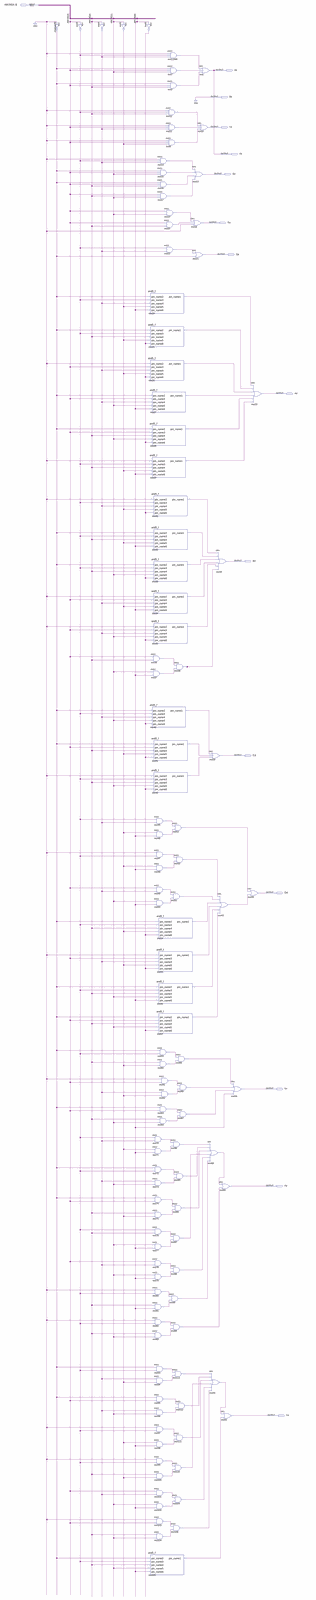
[diagram p0: schematic sheet, whole]
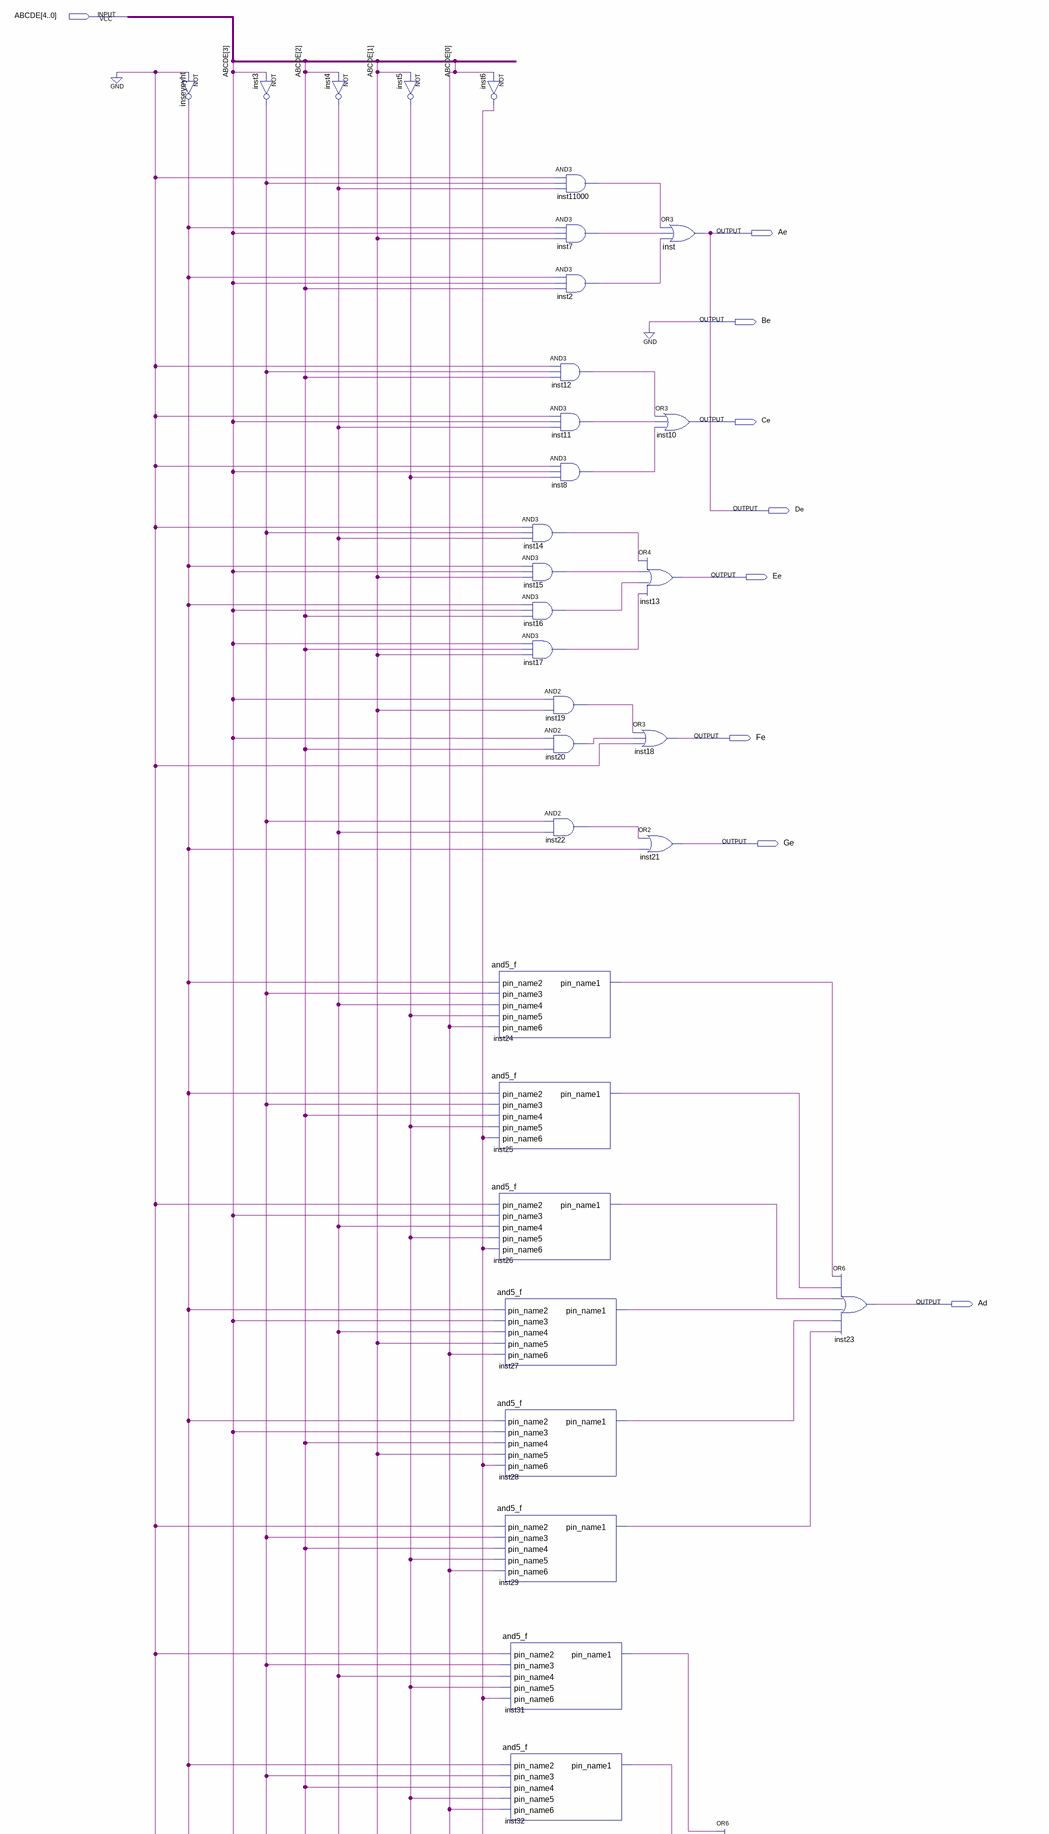
[diagram p1: schematic sheet, upper part]
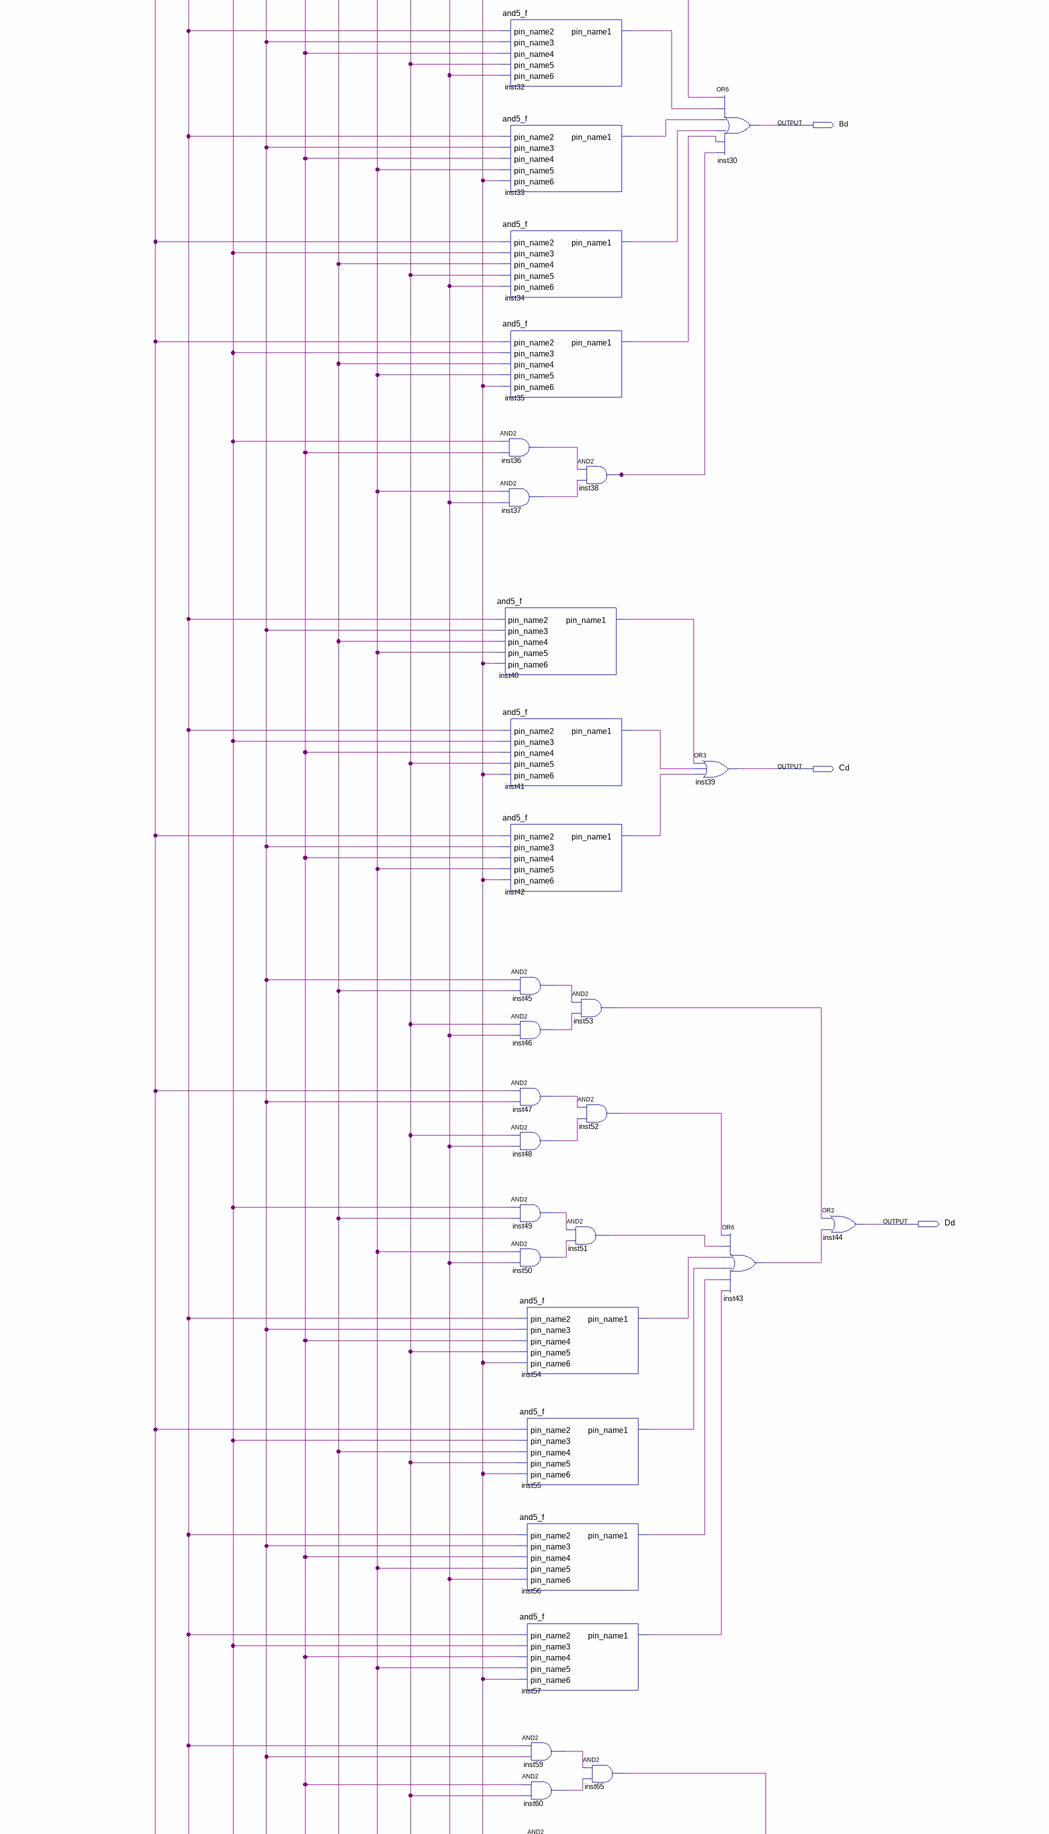
[diagram p2: schematic sheet, middle part]
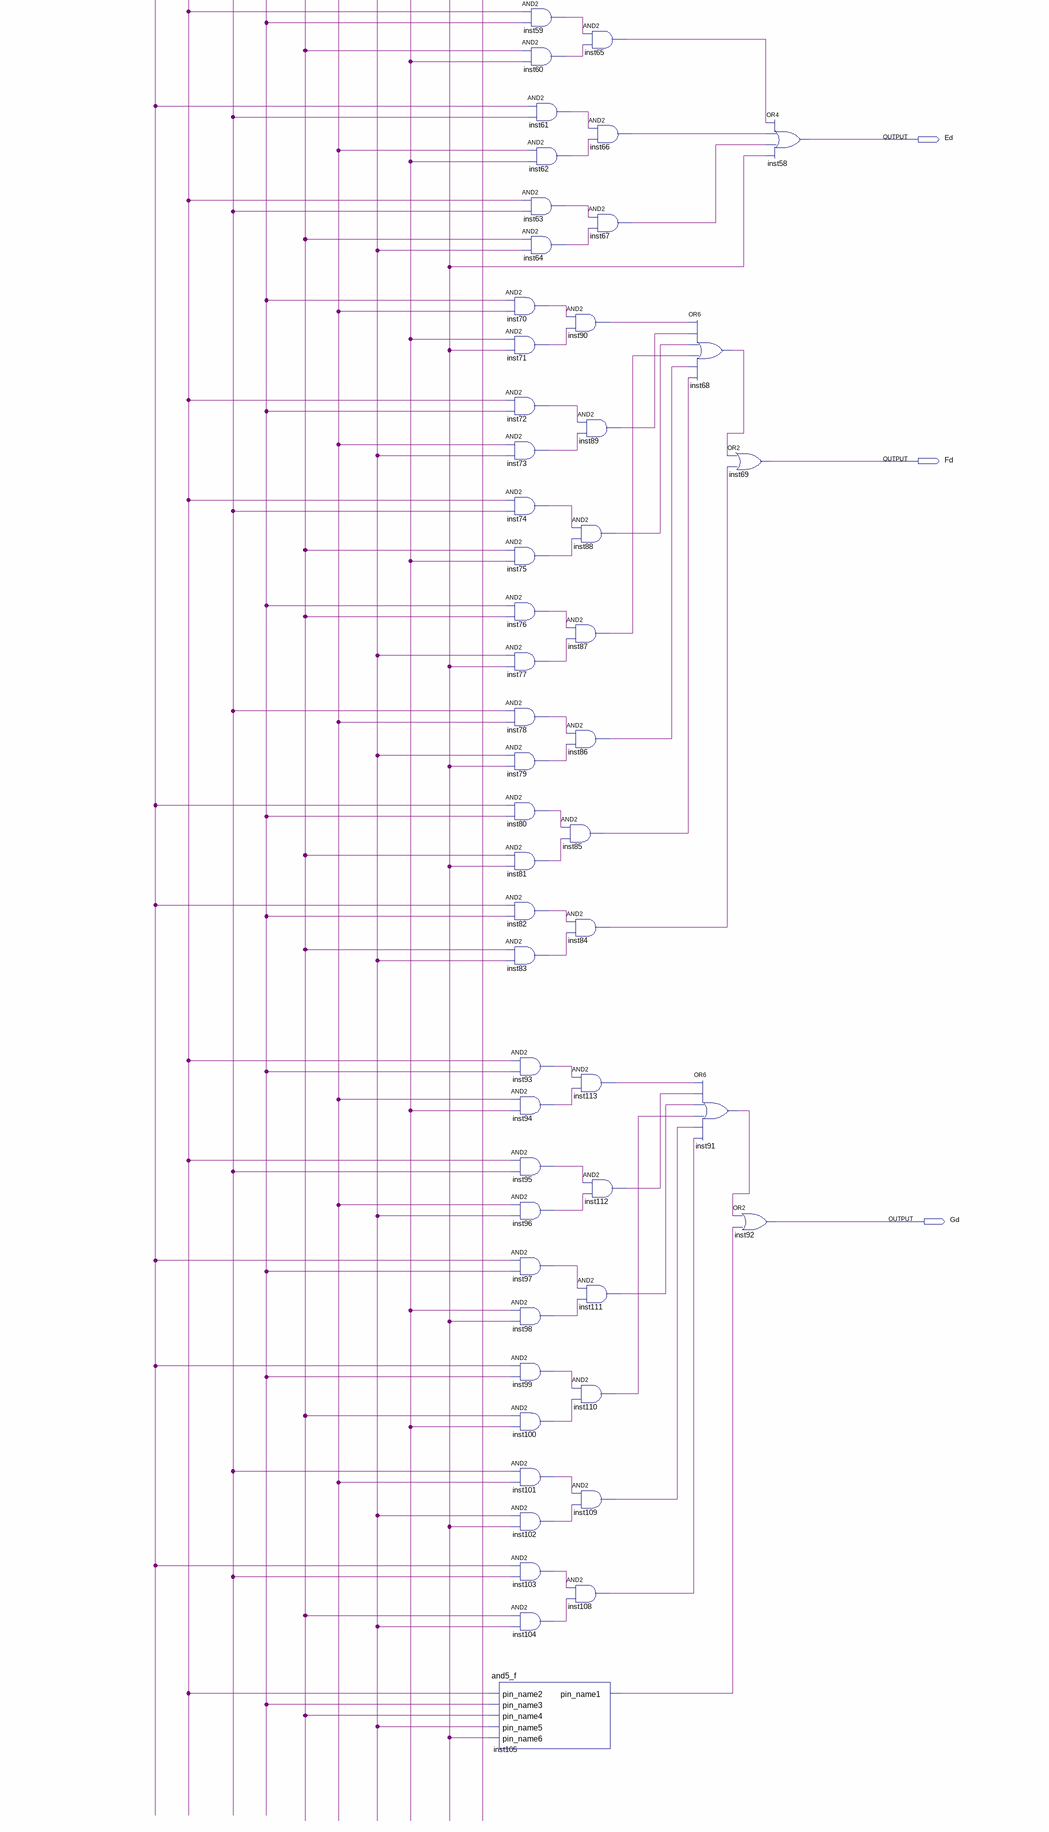
[diagram p3: schematic sheet, lower part]
// Quartus schematic DEC_4BITS.bdf as structural Verilog: 112 symbols, 15 pins
module DEC_4BITS (
  input  [4:0] ABCDE,
  output Ae,
  output Be,
  output Ce,
  output De,
  output Ee,
  output Fe,
  output Ge,
  output Ad,
  output Bd,
  output Cd,
  output Dd,
  output Ed,
  output Fd,
  output Gd
);

  wire inseyeyht_out, inst2_out, inst3_out, inst4_out, inst5_out, inst6_out, inst7_out, inst8_out,
       inst11_out, inst12_out, inst14_out, inst15_out, inst16_out, inst17_out, inst19_out, inst20_out,
       inst22_out, inst24_pin_name1, inst25_pin_name1, inst26_pin_name1, inst27_pin_name1, inst28_pin_name1,
       inst29_pin_name1, inst31_pin_name1, inst32_pin_name1, inst33_pin_name1, inst34_pin_name1,
       inst35_pin_name1, inst36_out, inst37_out, inst38_out, inst40_pin_name1, inst41_pin_name1,
       inst42_pin_name1, inst43_out, inst45_out, inst46_out, inst47_out, inst48_out, inst49_out, inst50_out,
       inst51_out, inst52_out, inst53_out, inst54_pin_name1, inst55_pin_name1, inst56_pin_name1,
       inst57_pin_name1, inst59_out, inst60_out, inst61_out, inst62_out, inst63_out, inst64_out, inst65_out,
       inst66_out, inst67_out, inst68_out, inst70_out, inst71_out, inst72_out, inst73_out, inst74_out,
       inst75_out, inst76_out, inst77_out, inst78_out, inst79_out, inst80_out, inst81_out, inst82_out,
       inst83_out, inst84_out, inst85_out, inst86_out, inst87_out, inst88_out, inst89_out, inst90_out,
       inst91_out, inst93_out, inst94_out, inst95_out, inst96_out, inst97_out, inst98_out, inst99_out,
       inst100_out, inst101_out, inst102_out, inst103_out, inst104_out, inst105_pin_name1, inst108_out,
       inst109_out, inst110_out, inst111_out, inst112_out, inst113_out, inst11000_out;

  not inseyeyht (inseyeyht_out, 1'b0);
  not inst3 (inst3_out, ABCDE[3]);
  not inst4 (inst4_out, ABCDE[2]);
  not inst5 (inst5_out, ABCDE[1]);
  not inst6 (inst6_out, ABCDE[0]);
  and5_f inst24 (
    .pin_name2(inseyeyht_out), .pin_name3(inst3_out), .pin_name4(inst4_out), .pin_name5(inst5_out),
    .pin_name6(ABCDE[0]), .pin_name1(inst24_pin_name1));
  and5_f inst25 (
    .pin_name2(inseyeyht_out), .pin_name3(inst3_out), .pin_name4(ABCDE[2]), .pin_name5(inst5_out),
    .pin_name6(inst6_out), .pin_name1(inst25_pin_name1));
  and5_f inst26 (
    .pin_name2(1'b0), .pin_name3(ABCDE[3]), .pin_name4(inst4_out), .pin_name5(inst5_out),
    .pin_name6(inst6_out), .pin_name1(inst26_pin_name1));
  and5_f inst27 (
    .pin_name2(inseyeyht_out), .pin_name3(ABCDE[3]), .pin_name4(inst4_out), .pin_name5(ABCDE[1]),
    .pin_name6(ABCDE[0]), .pin_name1(inst27_pin_name1));
  and5_f inst28 (
    .pin_name2(inseyeyht_out), .pin_name3(ABCDE[3]), .pin_name4(ABCDE[2]), .pin_name5(ABCDE[1]),
    .pin_name6(inst6_out), .pin_name1(inst28_pin_name1));
  and5_f inst29 (
    .pin_name2(1'b0), .pin_name3(inst3_out), .pin_name4(ABCDE[2]), .pin_name5(inst5_out),
    .pin_name6(ABCDE[0]), .pin_name1(inst29_pin_name1));
  and5_f inst31 (
    .pin_name2(1'b0), .pin_name3(inst3_out), .pin_name4(inst4_out), .pin_name5(inst5_out),
    .pin_name6(inst6_out), .pin_name1(inst31_pin_name1));
  and5_f inst32 (
    .pin_name2(inseyeyht_out), .pin_name3(inst3_out), .pin_name4(ABCDE[2]), .pin_name5(inst5_out),
    .pin_name6(ABCDE[0]), .pin_name1(inst32_pin_name1));
  and5_f inst33 (
    .pin_name2(inseyeyht_out), .pin_name3(inst3_out), .pin_name4(ABCDE[2]), .pin_name5(ABCDE[1]),
    .pin_name6(inst6_out), .pin_name1(inst33_pin_name1));
  and5_f inst34 (
    .pin_name2(1'b0), .pin_name3(ABCDE[3]), .pin_name4(inst4_out), .pin_name5(inst5_out),
    .pin_name6(ABCDE[0]), .pin_name1(inst34_pin_name1));
  and5_f inst35 (
    .pin_name2(1'b0), .pin_name3(ABCDE[3]), .pin_name4(inst4_out), .pin_name5(ABCDE[1]),
    .pin_name6(inst6_out), .pin_name1(inst35_pin_name1));
  and inst36 (inst36_out, ABCDE[3], ABCDE[2]);
  and inst37 (inst37_out, ABCDE[1], ABCDE[0]);
  and5_f inst40 (
    .pin_name2(inseyeyht_out), .pin_name3(inst3_out), .pin_name4(inst4_out), .pin_name5(ABCDE[1]),
    .pin_name6(inst6_out), .pin_name1(inst40_pin_name1));
  and5_f inst41 (
    .pin_name2(inseyeyht_out), .pin_name3(ABCDE[3]), .pin_name4(ABCDE[2]), .pin_name5(inst5_out),
    .pin_name6(inst6_out), .pin_name1(inst41_pin_name1));
  and5_f inst42 (
    .pin_name2(1'b0), .pin_name3(inst3_out), .pin_name4(ABCDE[2]), .pin_name5(ABCDE[1]),
    .pin_name6(inst6_out), .pin_name1(inst42_pin_name1));
  and inst45 (inst45_out, inst3_out, inst4_out);
  and inst46 (inst46_out, inst5_out, ABCDE[0]);
  and inst47 (inst47_out, 1'b0, inst3_out);
  and inst48 (inst48_out, inst5_out, ABCDE[0]);
  and inst49 (inst49_out, ABCDE[3], inst4_out);
  and inst50 (inst50_out, ABCDE[1], ABCDE[0]);
  and inst70 (inst70_out, inst3_out, inst4_out);
  and inst71 (inst71_out, inst5_out, ABCDE[0]);
  and inst72 (inst72_out, inseyeyht_out, inst3_out);
  and inst73 (inst73_out, inst4_out, ABCDE[1]);
  and inst74 (inst74_out, inseyeyht_out, ABCDE[3]);
  and inst75 (inst75_out, ABCDE[2], inst5_out);
  and inst76 (inst76_out, inst3_out, ABCDE[2]);
  and inst77 (inst77_out, ABCDE[1], ABCDE[0]);
  and inst78 (inst78_out, ABCDE[3], inst4_out);
  and inst79 (inst79_out, ABCDE[1], ABCDE[0]);
  and inst80 (inst80_out, 1'b0, inst3_out);
  and inst81 (inst81_out, ABCDE[2], ABCDE[0]);
  and inst82 (inst82_out, 1'b0, inst3_out);
  and inst83 (inst83_out, ABCDE[2], ABCDE[1]);
  and inst93 (inst93_out, inseyeyht_out, inst3_out);
  and inst94 (inst94_out, inst4_out, inst5_out);
  and inst95 (inst95_out, inseyeyht_out, ABCDE[3]);
  and inst96 (inst96_out, inst4_out, ABCDE[1]);
  and inst97 (inst97_out, 1'b0, inst3_out);
  and inst98 (inst98_out, inst5_out, ABCDE[0]);
  and inst99 (inst99_out, 1'b0, inst3_out);
  and inst100 (inst100_out, ABCDE[2], inst5_out);
  and inst101 (inst101_out, ABCDE[3], inst4_out);
  and inst102 (inst102_out, ABCDE[1], ABCDE[0]);
  and inst103 (inst103_out, 1'b0, ABCDE[3]);
  and inst104 (inst104_out, ABCDE[2], ABCDE[1]);
  and5_f inst105 (
    .pin_name2(inseyeyht_out), .pin_name3(inst3_out), .pin_name4(ABCDE[2]), .pin_name5(ABCDE[1]),
    .pin_name6(ABCDE[0]), .pin_name1(inst105_pin_name1));
  and inst11000 (inst11000_out, 1'b0, inst3_out, inst4_out);
  and inst7 (inst7_out, inseyeyht_out, ABCDE[3], ABCDE[1]);
  and inst2 (inst2_out, inseyeyht_out, ABCDE[3], ABCDE[2]);
  and inst12 (inst12_out, 1'b0, inst3_out, ABCDE[2]);
  and inst11 (inst11_out, 1'b0, ABCDE[3], inst4_out);
  and inst8 (inst8_out, 1'b0, ABCDE[3], inst5_out);
  and inst14 (inst14_out, 1'b0, inst3_out, inst4_out);
  and inst15 (inst15_out, inseyeyht_out, ABCDE[3], ABCDE[1]);
  and inst16 (inst16_out, inseyeyht_out, ABCDE[3], ABCDE[2]);
  and inst17 (inst17_out, ABCDE[3], ABCDE[2], ABCDE[1]);
  and inst19 (inst19_out, ABCDE[3], ABCDE[1]);
  and inst20 (inst20_out, ABCDE[3], ABCDE[2]);
  and inst22 (inst22_out, inst3_out, inst4_out);
  and5_f inst54 (
    .pin_name2(inseyeyht_out), .pin_name3(inst3_out), .pin_name4(ABCDE[2]), .pin_name5(inst5_out),
    .pin_name6(inst6_out), .pin_name1(inst54_pin_name1));
  and5_f inst55 (
    .pin_name2(1'b0), .pin_name3(ABCDE[3]), .pin_name4(inst4_out), .pin_name5(inst5_out),
    .pin_name6(inst6_out), .pin_name1(inst55_pin_name1));
  and5_f inst56 (
    .pin_name2(inseyeyht_out), .pin_name3(inst3_out), .pin_name4(ABCDE[2]), .pin_name5(ABCDE[1]),
    .pin_name6(ABCDE[0]), .pin_name1(inst56_pin_name1));
  and5_f inst57 (
    .pin_name2(inseyeyht_out), .pin_name3(ABCDE[3]), .pin_name4(ABCDE[2]), .pin_name5(ABCDE[1]),
    .pin_name6(inst6_out), .pin_name1(inst57_pin_name1));
  and inst59 (inst59_out, inseyeyht_out, inst3_out);
  and inst60 (inst60_out, ABCDE[2], inst5_out);
  and inst61 (inst61_out, 1'b0, ABCDE[3]);
  and inst62 (inst62_out, inst4_out, inst5_out);
  and inst63 (inst63_out, inseyeyht_out, ABCDE[3]);
  and inst64 (inst64_out, ABCDE[2], ABCDE[1]);
  and inst38 (inst38_out, inst36_out, inst37_out);
  and inst53 (inst53_out, inst45_out, inst46_out);
  and inst52 (inst52_out, inst47_out, inst48_out);
  and inst51 (inst51_out, inst49_out, inst50_out);
  and inst65 (inst65_out, inst59_out, inst60_out);
  and inst66 (inst66_out, inst61_out, inst62_out);
  and inst67 (inst67_out, inst63_out, inst64_out);
  and inst90 (inst90_out, inst70_out, inst71_out);
  and inst89 (inst89_out, inst72_out, inst73_out);
  and inst88 (inst88_out, inst74_out, inst75_out);
  and inst87 (inst87_out, inst76_out, inst77_out);
  and inst86 (inst86_out, inst78_out, inst79_out);
  and inst85 (inst85_out, inst80_out, inst81_out);
  and inst84 (inst84_out, inst82_out, inst83_out);
  and inst113 (inst113_out, inst93_out, inst94_out);
  and inst112 (inst112_out, inst95_out, inst96_out);
  and inst111 (inst111_out, inst97_out, inst98_out);
  and inst110 (inst110_out, inst99_out, inst100_out);
  and inst109 (inst109_out, inst101_out, inst102_out);
  and inst108 (inst108_out, inst103_out, inst104_out);
  or inst13 (Ee, inst14_out, inst15_out, inst16_out, inst17_out);
  or inst18 (Fe, inst19_out, inst20_out, 1'b0);
  or inst21 (Ge, inst22_out, inseyeyht_out);
  or inst (Ae, inst11000_out, inst7_out, inst2_out);
  or inst10 (Ce, inst12_out, inst11_out, inst8_out);
  or inst68 (inst68_out, inst90_out, inst89_out, inst88_out, inst87_out, inst86_out, inst85_out);
  or inst30 (Bd, inst31_pin_name1, inst32_pin_name1, inst33_pin_name1, inst34_pin_name1, inst35_pin_name1, inst38_out);
  or inst39 (Cd, inst40_pin_name1, inst41_pin_name1, inst42_pin_name1);
  or inst43 (inst43_out, inst52_out, inst51_out, inst54_pin_name1, inst55_pin_name1, inst56_pin_name1, inst57_pin_name1);
  or inst69 (Fd, inst68_out, inst84_out);
  or inst91 (inst91_out, inst113_out, inst112_out, inst111_out, inst110_out, inst109_out, inst108_out);
  or inst92 (Gd, inst91_out, inst105_pin_name1);
  or inst58 (Ed, inst65_out, inst66_out, inst67_out, ABCDE[0]);
  or inst44 (Dd, inst53_out, inst43_out);
  or inst23 (Ad, inst24_pin_name1, inst25_pin_name1, inst26_pin_name1, inst27_pin_name1, inst28_pin_name1, inst29_pin_name1);

  assign Be = 1'b0;
  assign De = Ae;
endmodule
